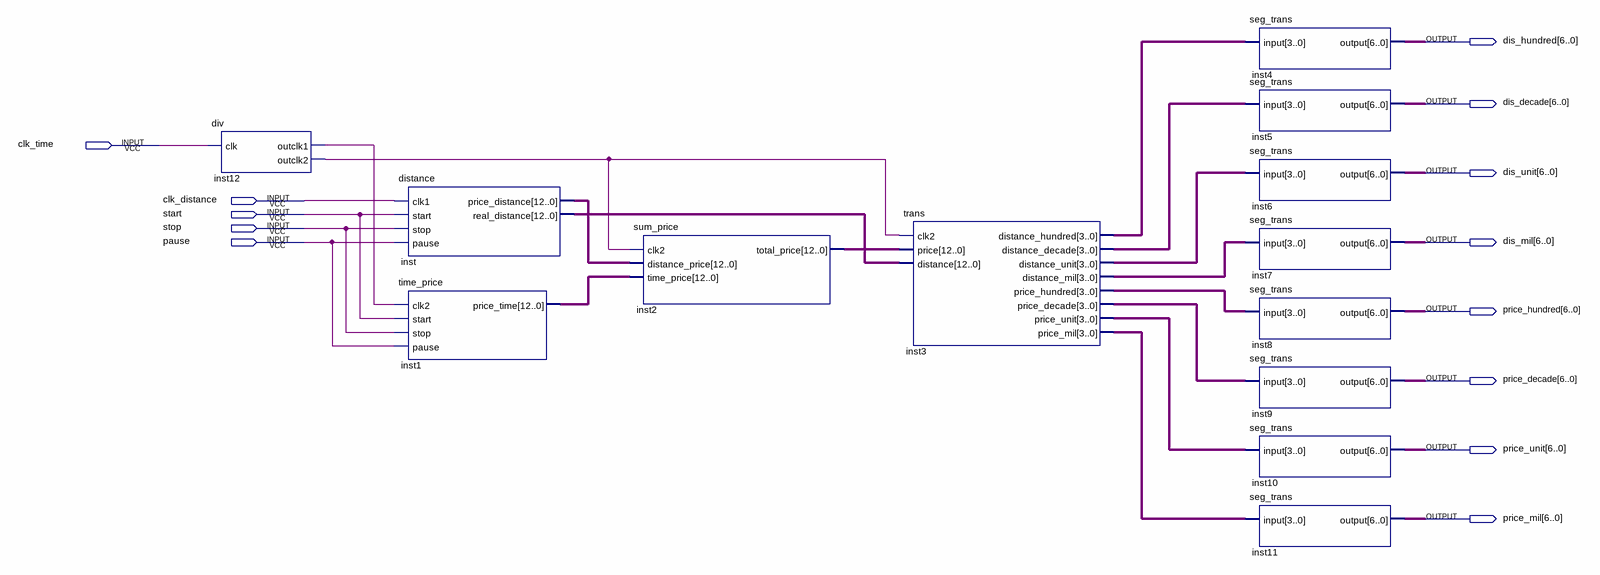
[diagram p0: schematic sheet]
// Quartus schematic taxi.bdf as structural Verilog: 13 symbols, 13 pins
module taxi (
  input  clk_time,
  input  clk_distance,
  input  start,
  input  stop,
  input  pause,
  output [6:0] dis_hundred,
  output [6:0] dis_decade,
  output [6:0] dis_unit,
  output [6:0] dis_mil,
  output [6:0] price_hundred,
  output [6:0] price_decade,
  output [6:0] price_unit,
  output [6:0] price_mil
);

  wire inst12_outclk1, inst12_outclk2;
  wire [3:0] inst3_distance_decade, inst3_distance_hundred, inst3_distance_mil, inst3_distance_unit,
       inst3_price_decade, inst3_price_hundred, inst3_price_mil, inst3_price_unit;
  wire [12:0] inst1_price_time, inst2_total_price, inst_price_distance, inst_real_distance;

  div inst12 (.clk(clk_time), .outclk1(inst12_outclk1), .outclk2(inst12_outclk2));
  distance inst (
    .clk1(clk_distance), .start(start), .stop(stop), .pause(pause), .price_distance(inst_price_distance),
    .real_distance(inst_real_distance));
  time_price inst1 (.clk2(inst12_outclk1), .start(start), .stop(stop), .pause(pause), .price_time(inst1_price_time));
  sum_price inst2 (
    .clk2(inst12_outclk2), .distance_price(inst_price_distance), .time_price(inst1_price_time),
    .total_price(inst2_total_price));
  trans inst3 (
    .clk2(inst12_outclk2), .price(inst2_total_price), .distance(inst_real_distance),
    .distance_hundred(inst3_distance_hundred), .distance_decade(inst3_distance_decade),
    .distance_unit(inst3_distance_unit), .distance_mil(inst3_distance_mil),
    .price_hundred(inst3_price_hundred), .price_decade(inst3_price_decade), .price_unit(inst3_price_unit),
    .price_mil(inst3_price_mil));
  seg_trans inst4 (.\input (inst3_distance_hundred), .\output (dis_hundred));
  seg_trans inst5 (.\input (inst3_distance_decade), .\output (dis_decade));
  seg_trans inst6 (.\input (inst3_distance_unit), .\output (dis_unit));
  seg_trans inst7 (.\input (inst3_distance_mil), .\output (dis_mil));
  seg_trans inst8 (.\input (inst3_price_hundred), .\output (price_hundred));
  seg_trans inst9 (.\input (inst3_price_decade), .\output (price_decade));
  seg_trans inst10 (.\input (inst3_price_unit), .\output (price_unit));
  seg_trans inst11 (.\input (inst3_price_mil), .\output (price_mil));
endmodule
